# EAGLE board shimboard_revC_V5 (EAGLE 9.1.1), part 1 of 3
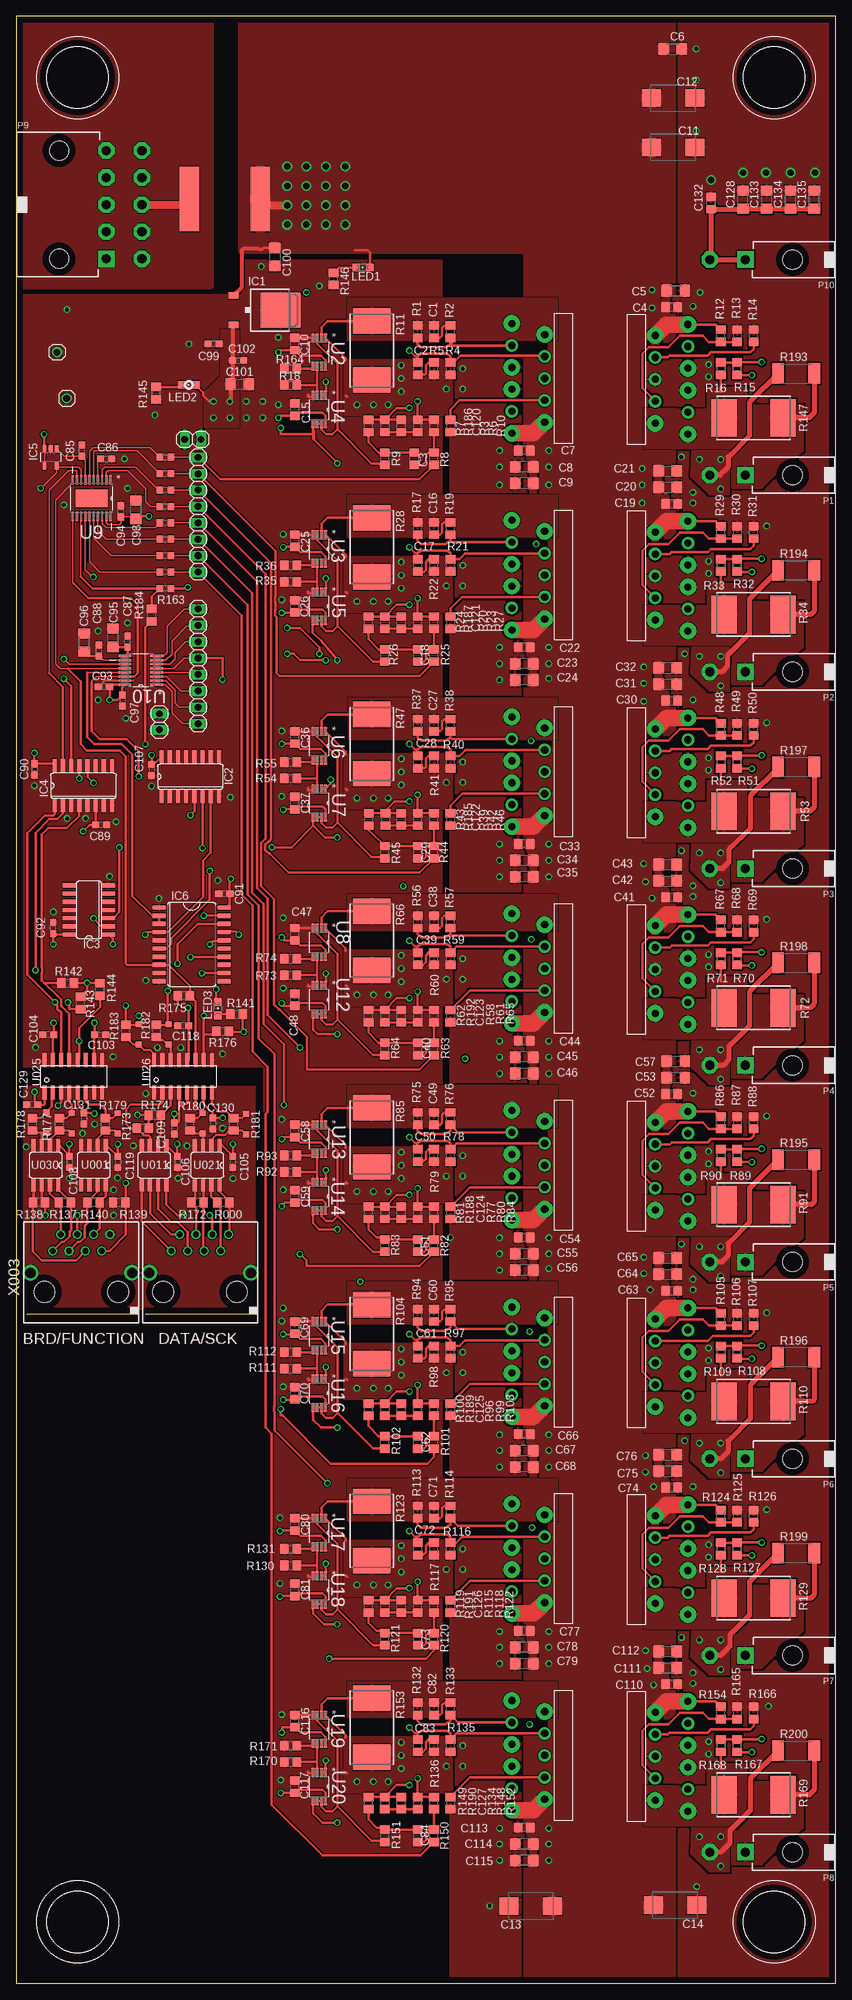
[diagram p5: board, top side]
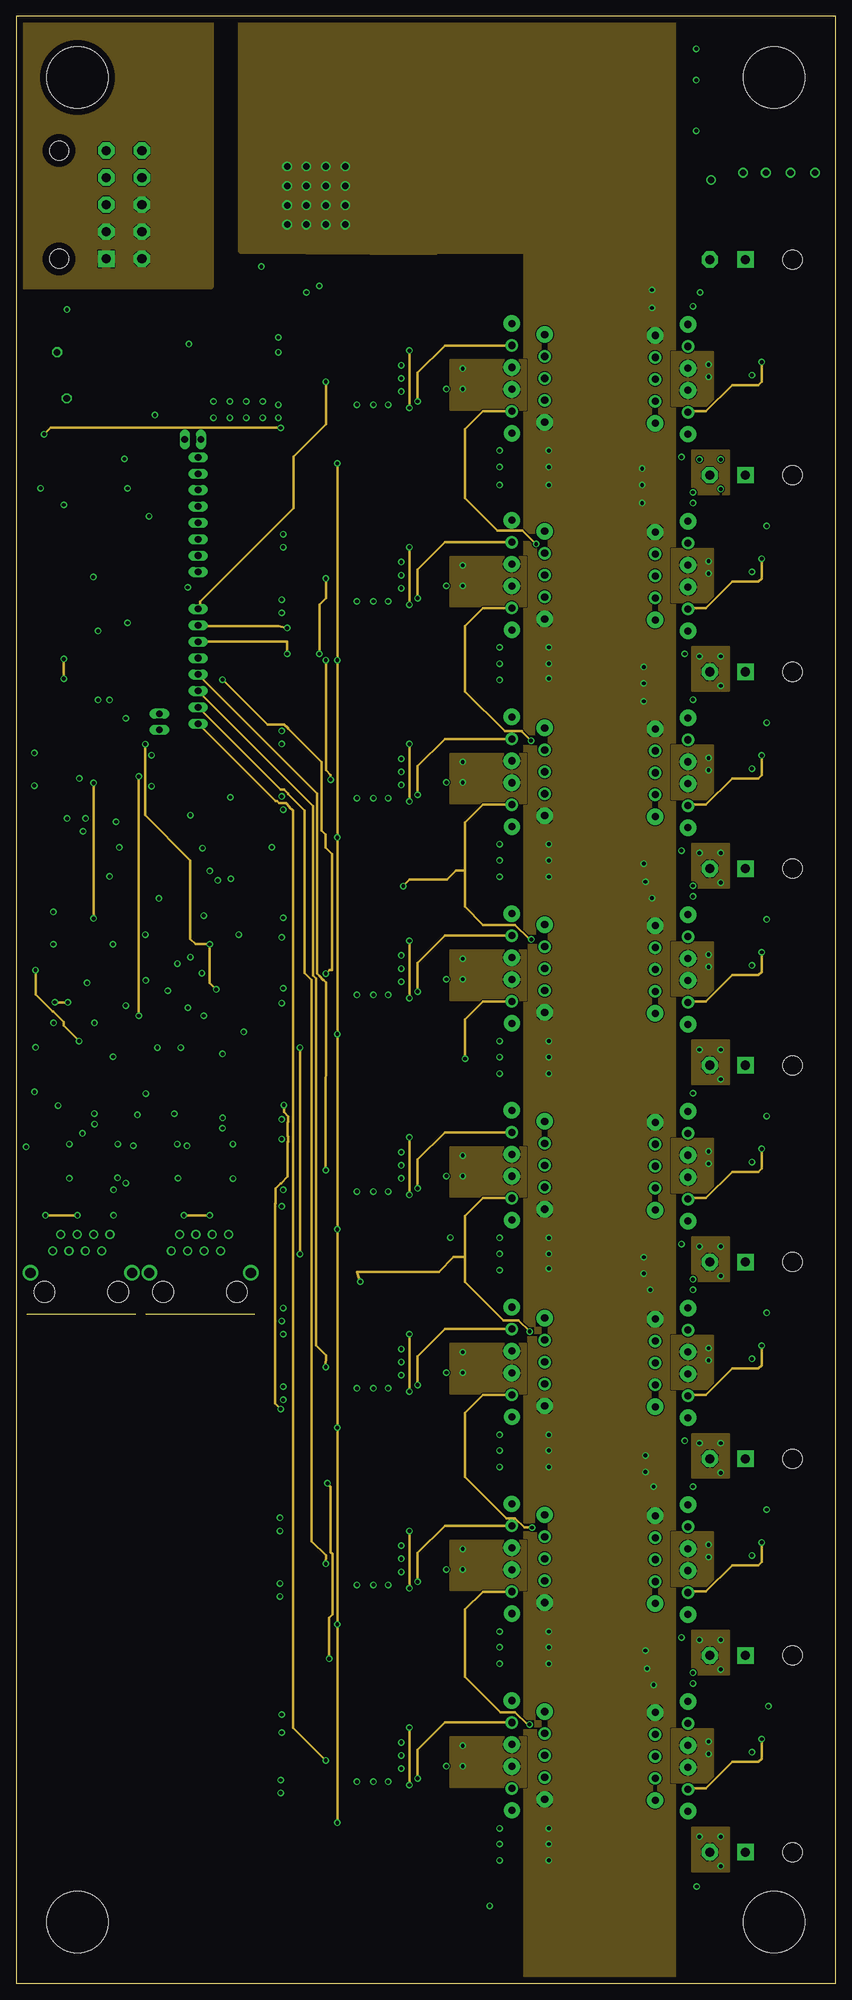
[diagram p6: board, inner layer Route2]
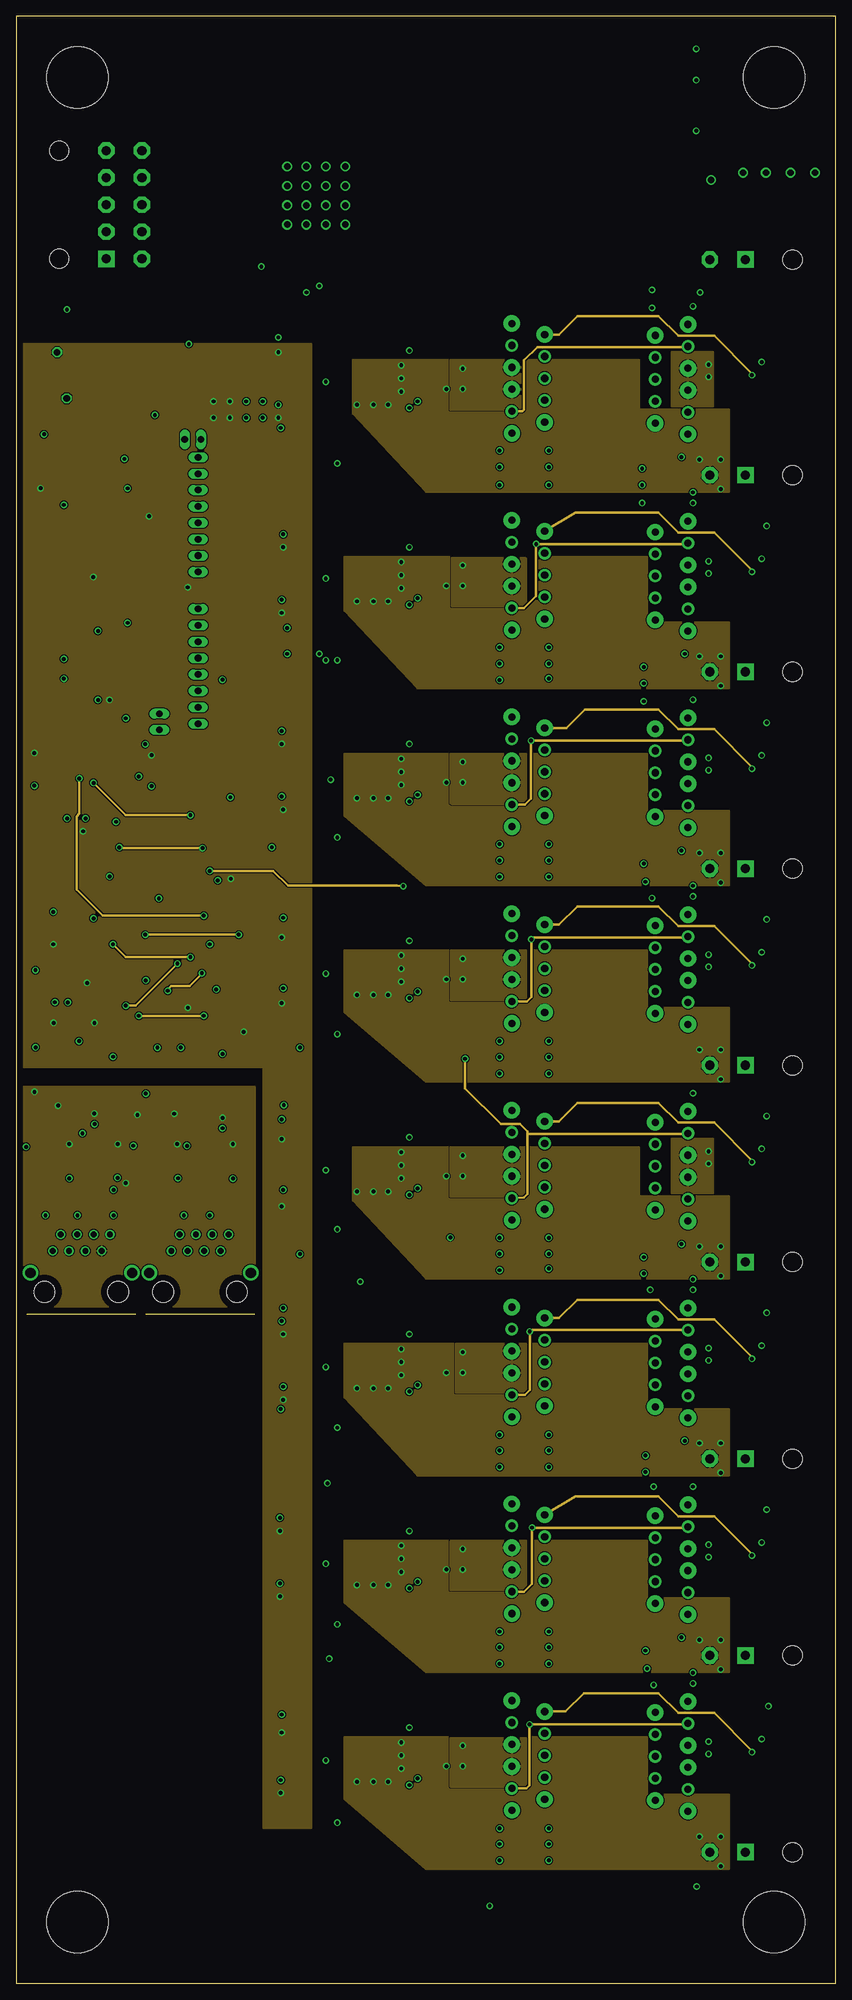
[diagram p7: board, inner layer Route15]
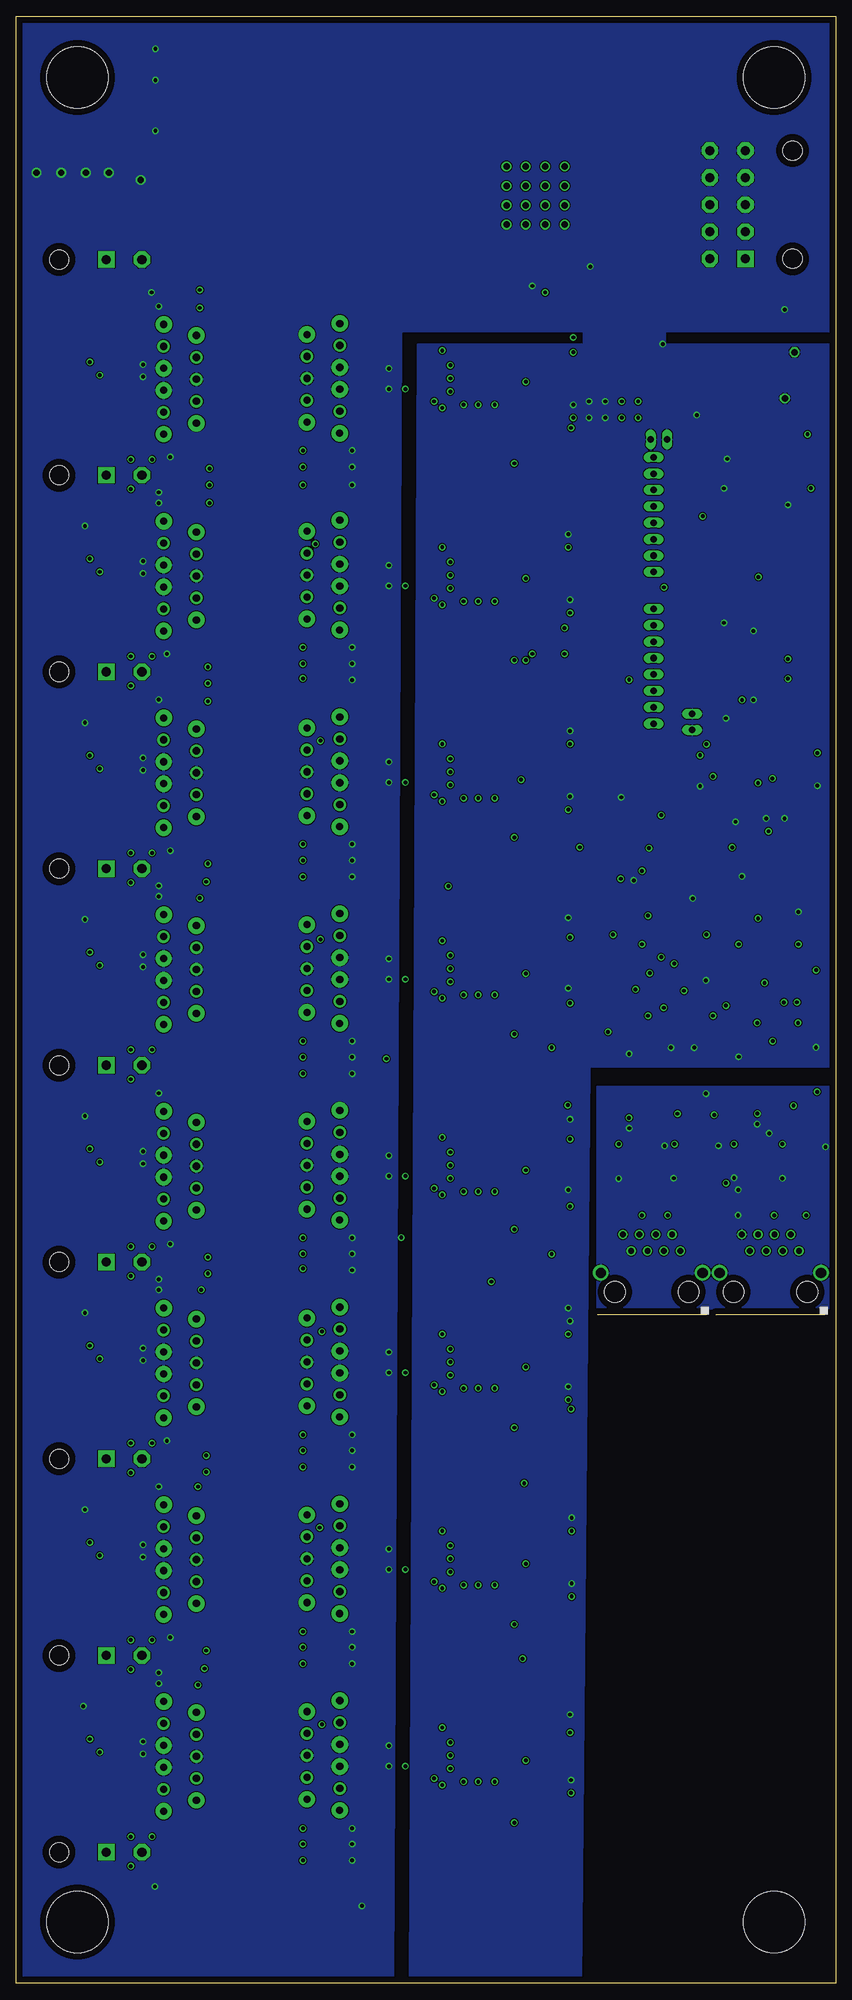
[diagram p8: board, bottom side, seen from below]

Size 127 x 304.8 mm. Coordinates in mm from the lower left corner, seen from the top.
Outline: 0,0 127,0 127,304.8 0,304.8 0,0
Copper layers (1+2*15+16): Top 0.035mm / dielectric 0.5mm / Route2 0.035mm / dielectric 0.5mm / Route15 0.035mm / dielectric 0.5mm / Bottom 0.035mm
Design rules "default *": minimum track width 10mil, minimum drill 0.3mm, track to track 6mil, track to pad 6mil, pad to pad 6mil, via to via 0.3mm, smd to smd 6mil, copper to edge 40mil, drill to drill 0.3mm, minimum pad ring 10mil, minimum via ring 8mil, stop-mask expansion 4mil, vias tented up to drill 0mil, thermal gap 6mil
Holes 9.53 mm at 9.53,9.53 117.47,9.53 9.53,295.27 117.47,295.27
tKeepout: area 3.4,3.4 to 15.6,15.6; area 111.4,3.4 to 123.6,15.6; area 3.4,289.2 to 15.6,301.4; area 111.4,289.2 to 123.6,301.4

## Footprints (pad centres in the part's own frame; a part is rotated, then mirrored left to right if it is on the bottom)
C0805 = smd 1.3 x 1.5: 1 -0.95,0; 2 0.95,0
C1206 = smd 1.6 x 1.8: 1 -1.4,0; 2 1.4,0
D/7343-31W = smd 2.95 x 2.7: + 3.375,0; - -3.375,0
C0603 = smd 1.1 x 1: 1 -0.85,0; 2 0.85,0
LINEAR_TO252 = smd 1 x 1.6: 1 -2.28,-4.8; 2 2.28,-4.8 | smd 5.4 x 6.2: 3 0,2.5
SO16 = smd 0.66 x 2.032: 1 -4.445,-3.073; 2 -3.175,-3.073; 3 -1.905,-3.073; 4 -0.635,-3.073; 5 0.635,-3.073; 6 1.905,-3.073; 7 3.175,-3.073; 8 4.445,-3.073; 9 4.445,3.073; 10 3.175,3.073; 11 1.905,3.073; 12 0.635,3.073; 13 -0.635,3.073; 14 -1.905,3.073; 15 -3.175,3.073; 16 -4.445,3.073
SO14 = smd 0.66 x 2.032: 1 -3.81,-3.073; 2 -2.54,-3.073; 3 -1.27,-3.073; 4 0,-3.073; 5 1.27,-3.073; 6 2.54,-3.073; 7 3.81,-3.073; 8 3.81,3.073; 9 2.54,3.073; 10 1.27,3.073; 11 0,3.073; 12 -1.27,3.073; 13 -2.54,3.073; 14 -3.81,3.073
SOT23-5 = smd 0.6 x 1.2: 1 -0.95,-1.306; 2 0,-1.306; 3 0.95,-1.306; 4 0.95,1.306; 5 -0.95,1.306
SO20W = smd 0.66 x 2.032: 1 -5.715,-5.029; 2 -4.445,-5.029; 3 -3.175,-5.029; 4 -1.905,-5.029; 5 -0.635,-5.029; 6 0.635,-5.029; 7 1.905,-5.029; 8 3.175,-5.029; 9 4.445,-5.029; 10 5.715,-5.029; 11 5.715,5.029; 12 4.445,5.029; 13 3.175,5.029; 14 1.905,5.029; 15 0.635,5.029; 16 -0.635,5.029; 17 -1.905,5.029; 18 -3.175,5.029; 19 -4.445,5.029; 20 -5.715,5.029
1X08 = drill 1.016 long: 1 -8.89,0; 2 -6.35,0; 3 -3.81,0; 4 -1.27,0; 5 1.27,0; 6 3.81,0; 7 6.35,0; 8 8.89,0
1X02 = drill 1.016 long: 1 -1.27,0; 2 1.27,0
1X01 = drill 1.016 octagon: 1 0,0
CHIPLED_0805 = smd 1.2 x 1.2: A 0,-1.05; C 0,1.05
39-30-?02? = drill 1.422 pad 2.54 square: 1 0,0 | drill 1.422 pad 2.54 octagon: 2 0,5.512 | hole 3: 0,-7.3
39-30-?10? = drill 1.422 pad 2.54 square: 1 8.382,0 | drill 1.422 pad 2.54 octagon: 2 4.191,0; 3 0,0; 4 -4.191,0; 5 -8.382,0; 6 8.382,5.512; 7 4.191,5.512; 8 0,5.512; 9 -4.191,5.512; 10 -8.382,5.512 | hole 3: -8.382,-7.3; 8.382,-7.3
R0805 = smd 1.3 x 1.5: 1 -0.95,0; 2 0.95,0
R4527 = smd 3.94 x 5.84: 1 -4.575,0; 2 4.575,0
M0805 = smd 1.3 x 1.6: 1 -0.95,0; 2 0.95,0
R0603 = smd 1 x 1.1: 1 -0.85,0; 2 0.85,0
R2512 = smd 1.8 x 3.2: 1 -2.8,0; 2 2.8,0
SO08-1 = smd 0.66 x 2.032: 1 -1.905,-3.073; 2 -0.635,-3.073; 3 0.635,-3.073; 4 1.905,-3.073; 5 1.905,3.073; 6 0.635,3.073; 7 -0.635,3.073; 8 -1.905,3.073
SOP65P490X110-8N = smd 1.422 x 0.432: 1 -2.184,0.965; 2 -2.184,0.33; 3 -2.184,-0.33; 4 -2.184,-0.965; 5 2.184,-0.965; 6 2.184,-0.33; 7 2.184,0.33; 8 2.184,0.965
SOP65P640X120-21N = smd 1.473 x 0.356: 1 -2.819,2.921; 2 -2.819,2.286; 3 -2.819,1.626; 4 -2.819,0.965; 5 -2.819,0.33; 6 -2.819,-0.33; 7 -2.819,-0.965; 8 -2.819,-1.626; 9 -2.819,-2.286; 10 -2.819,-2.921; 11 2.819,-2.921; 12 2.819,-2.286; 13 2.819,-1.626; 14 2.819,-0.965; 15 2.819,-0.33; 16 2.819,0.33; 17 2.819,0.965; 18 2.819,1.626; 19 2.819,2.286; 20 2.819,2.921 | smd 2.743 x 4.953: 21 0,0
SOP63P600X175-16N = smd 1.981 x 0.356: 1 -2.464,2.235; 2 -2.464,1.575; 3 -2.464,0.965; 4 -2.464,0.305; 5 -2.464,-0.305; 6 -2.464,-0.965; 7 -2.464,-1.575; 8 -2.464,-2.235; 9 2.464,-2.235; 10 2.464,-1.575; 11 2.464,-0.965; 12 2.464,-0.305; 13 2.464,0.305; 14 2.464,0.965; 15 2.464,1.575; 16 2.464,2.235
ACSL-SO16 = smd 2.16 x 0.64: 1 -0.96,9.6; 2 -0.96,8.32; 3 -0.96,7.04; 4 -0.96,5.76; 5 -0.96,4.48; 6 -0.96,3.2; 7 -0.96,1.92; 8 -0.96,0.64; 9 4.05,0.64; 10 4.05,1.92; 11 4.05,3.2; 12 4.05,4.48; 13 4.05,5.76; 14 4.05,7.04; 15 4.05,8.32; 16 4.05,9.6
881 = smd 3 x 10: P$1 -5,0; P$2 6,0
1N4148 = smd 0.9 x 0.95: 1 -1.6,0; 2 1.55,0
OPA549 = drill 1.1 pad 2.54: PIN$1 0,0; PIN$2 1.7,5.08; PIN$5 6.8,0; PIN$7 10.2,0; PIN$10 15.3,5.08; PIN$11 17,0.02 | drill 1.1 pad 1.93: PIN$3 3.4,0; PIN$4 5.1,5.08; PIN$6 8.5,5.08; PIN$8 11.9,5.08; PIN$9 13.6,0
RJ45-VERTICAL = drill 0.9 pad 1.4: 1 -4.445,6.35; 2 -3.175,8.89; 3 -1.905,6.35; 4 -0.635,8.89; 5 0.635,6.35; 6 1.905,8.89; 7 3.175,6.35; 8 4.445,8.89 | drill 1.6 pad 2.1: G1 -7.875,2.95; G2 7.875,2.95 | hole 3.251: -5.715,0; 5.715,0

## Placement (x,y rotation side)
C1  100pF  [C0805]  64.77,255.91 90 top
C2  100pF  [C0805]  62.23,250.19 90 top
C3  1n  [C0805]  61.73,236.22 90 top
C4  0.1uF  [C0805]  101.6,259.71 0 top
C5  10uF  [C1206]  102.23,262.25 0 top
C6  10uF  [C1206]  101.73,299.72 0 top
C7  0.1uF  [C0805]  78.74,237.49 180 top
C8  10uF  [C1206]  78.74,234.95 180 top
C9  10uF  [C1206]  78.74,232.41 180 top
C10  0.1uF  [C0805]  43.18,254 90 top
C11  100u  [D/7343-31W]  101.85,284.48 180 top
C12  100u  [D/7343-31W]  101.85,292.1 180 top
C13  100u  [D/7343-31W]  79.76,11.99 0 top
C14  100u  [D/7343-31W]  102.11,12.11 180 top
C15  0.1uF  [C0805]  43.18,243.84 90 top
C16  100pF  [C0805]  64.77,225.43 90 top
C17  100pF  [C0805]  62.23,219.71 90 top
C18  1n  [C0805]  62.23,205.74 90 top
C19  0.1uF  [C0805]  101.6,229.24 0 top
C20  10uF  [C1206]  100.97,231.78 0 top
C21  10uF  [C1206]  100.97,234.31 0 top
C22  0.1uF  [C0805]  78.74,207.01 180 top
C23  10uF  [C1206]  78.74,204.47 180 top
C24  10uF  [C1206]  78.74,201.93 180 top
C25  0.1uF  [C0805]  43.18,223.52 90 top
C26  0.1uF  [C0805]  43.18,213.36 90 top
C27  100pF  [C0805]  64.77,194.94 90 top
C28  100pF  [C0805]  62.23,189.23 90 top
C29  1n  [C0805]  62.23,175.26 90 top
C30  0.1uF  [C0805]  101.6,198.75 0 top
C31  10uF  [C1206]  100.97,201.29 0 top
C32  10uF  [C1206]  100.97,203.84 0 top
C33  0.1uF  [C0805]  78.74,176.53 180 top
C34  10uF  [C1206]  78.74,173.99 180 top
C35  10uF  [C1206]  78.74,171.45 180 top
C36  0.1uF  [C0805]  43.18,193.04 90 top
C37  0.1uF  [C0805]  43.18,182.88 90 top
C38  100pF  [C0805]  64.77,164.47 90 top
C39  100pF  [C0805]  62.23,158.75 90 top
C40  1n  [C0805]  62.23,144.78 90 top
C41  0.1uF  [C0805]  101.6,168.28 0 top
C42  10uF  [C1206]  100.97,170.81 0 top
C43  10uF  [C1206]  100.97,173.35 0 top
C44  0.1uF  [C0805]  78.74,146.05 180 top
C45  10uF  [C1206]  78.74,143.51 180 top
C46  10uF  [C1206]  78.74,140.97 180 top
C47  0.1uF  [C0805]  43.18,162.56 90 top
C48  0.1uF  [C0805]  43.18,152.4 90 top
C49  100pF  [C0805]  64.77,133.99 90 top
C50  100pF  [C0805]  62.23,128.27 90 top
C51  1n  [C0805]  62.23,114.3 90 top
C52  0.1uF  [C0805]  101.6,137.79 0 top
C53  10uF  [C1206]  102.23,140.34 0 top
C54  0.1uF  [C0805]  78.74,115.57 180 top
C55  10uF  [C1206]  78.74,113.03 180 top
C56  10uF  [C1206]  78.74,110.49 180 top
C57  10uF  [C1206]  102.23,142.88 0 top
C58  0.1uF  [C0805]  43.18,132.08 90 top
C59  0.1uF  [C0805]  43.18,121.92 90 top
C60  100pF  [C0805]  64.77,103.5 90 top
C61  100pF  [C0805]  62.23,97.79 90 top
C62  1n  [C0805]  62.23,83.82 90 top
C63  0.1uF  [C0805]  101.6,107.31 0 top
C64  10uF  [C1206]  100.97,109.86 0 top
C65  10uF  [C1206]  100.97,112.39 0 top
C66  0.1uF  [C0805]  78.74,85.09 180 top
C67  10uF  [C1206]  78.74,82.55 180 top
C68  10uF  [C1206]  78.74,80.01 180 top
C69  0.1uF  [C0805]  43.18,101.6 90 top
C70  0.1uF  [C0805]  43.18,91.44 90 top
C71  100pF  [C0805]  64.77,73.03 90 top
C72  100pF  [C0805]  62.23,67.31 90 top
C73  1n  [C0805]  62.23,53.34 90 top
C74  0.1uF  [C0805]  101.6,76.83 0 top
C75  10uF  [C1206]  100.97,79.38 0 top
C76  10uF  [C1206]  100.97,81.92 0 top
C77  0.1uF  [C0805]  78.74,54.61 180 top
C78  10uF  [C1206]  78.74,52.07 180 top
C79  10uF  [C1206]  78.74,49.53 180 top
C80  0.1uF  [C0805]  43.18,71.12 90 top
C81  0.1uF  [C0805]  43.18,60.96 90 top
C82  100pF  [C0805]  64.77,42.55 90 top
C83  100pF  [C0805]  62.23,36.83 90 top
C84  1n  [C0805]  62.23,22.86 90 top
C85  0.1uF  [C0603]  10.18,237.47 90 top
C86  0.1uF  [C0603]  13.99,236.2 0 top
C87  0.1uF  [C0603]  17.29,207.88 90 top
C88  0.1uF  [C0603]  12.84,206.48 90 top
C89  0.1uF  [C0603]  13.16,179.5 0 top
C90  0.1uF  [C0603]  2.81,188.11 270 top
C91  0.1uF  [C0603]  32.27,168.85 180 top
C92  0.1uF  [C0603]  5.75,163.5 90 top
C93  0.1uF  [C0603]  13.61,200.89 180 top
C94  0.1uF  [C0603]  16.27,228.07 90 top
C95  10uF  [C1206]  15,208.5 90 top
C96  10uF  [C1206]  10.56,207.73 90 top
C97  1uF  [C0603]  16.47,198.78 270 top
C98  10uF  [C1206]  18.56,228.32 90 top
C99  0.1uF  [C0603]  30.59,254 180 top
C100  10uF  [C1206]  40.09,267.5 270 top
C101  10uF  [C1206]  34.65,247.78 0 top
C102  0.1uF  [C0603]  34.4,251.46 0 top
C103  0.1uF  [C0603]  13,147 0 top
C104  0.1uF  [C0603]  5,147 180 top
C105  0.1uF  [C0603]  33.62,127.25 270 top
C106  0.1uF  [C0603]  25.01,127.25 270 top
C107  0.1uF  [C0603]  21,188 270 top
C108  0.1uF  [C0603]  8.25,127.25 270 top
C109  0.1uF  [C0603]  24.51,132.46 270 top
C110  0.1uF  [C0805]  101.6,46.35 0 top
C111  10uF  [C1206]  100.97,48.9 0 top
C112  10uF  [C1206]  100.97,51.44 0 top
C113  0.1uF  [C0805]  78.74,24.13 180 top
C114  10uF  [C1206]  78.74,21.59 180 top
C115  10uF  [C1206]  78.74,19.05 180 top
C116  0.1uF  [C0805]  43.18,40.64 90 top
C117  0.1uF  [C0805]  43.18,30.48 90 top
C118  0.1uF  [C0603]  25.9,148.4 180 top
C119  0.1uF  [C0603]  15.75,127.25 270 top
C120  220p  [C0805]  59.69,241.3 90 top
C121  220p  [C0805]  59.69,210.82 90 top
C122  220p  [C0805]  59.69,180.34 90 top
C123  220p  [C0805]  59.69,149.86 90 top
C124  220p  [C0805]  59.69,119.38 90 top
C125  220p  [C0805]  59.69,88.9 90 top
C126  220p  [C0805]  59.69,58.42 90 top
C127  220p  [C0805]  59.69,27.94 90 top
C128  10u  [C1206]  112.65,276.35 90 top
C129  0.1uF  [C0603]  2.5,136.12 180 top
C130  0.1uF  [C0603]  30.48,133.22 270 top
C131  0.1uF  [C0603]  10.5,133.98 270 top
C132  0.1u  [C0805]  107.7,275.84 90 top
C133  10u  [C1206]  116.33,276.35 90 top
C134  10u  [C1206]  120.02,276.35 90 top
C135  10u  [C1206]  123.7,276.35 90 top
IC1  LINEAR_7805DT  [LINEAR_TO252]  38.5,259.25 270 top
IC2  74LS279D  [SO16]  27,187 0 top
IC3  7400D  [SO14]  11.3,166.32 90 top
IC4  74LS138D  [SO16]  10.43,185.57 0 top
IC5  LMV321M5  [SOT23-5]  5.35,236.45 180 top
IC6  74LS240DW  [SO20W]  27.21,160.98 270 top
JP1  [1X08]  28.21,204.06 270 top
JP2  [1X08]  28.21,227.56 270 top
JP3  [1X02]  22.21,195.46 90 top
JP4  [1X02]  27.39,239.21 180 top
JP5  [1X01]  7.84,245.58 0 top
JP6  [1X01]  6.35,252.73 0 top
LED1  [CHIPLED_0805]  53.78,265.85 90 top
LED2  [CHIPLED_0805]  26.78,247.65 90 top
LED3  [CHIPLED_0805]  31.25,151 0 top
P1  39-30-02?_S  [39-30-?02?]  113.03,233.68 90 top
P2  39-30-02?_S  [39-30-?02?]  113.03,203.2 90 top
P3  39-30-02?_S  [39-30-?02?]  113.03,172.72 90 top
P4  39-30-02?_S  [39-30-?02?]  113.03,142.24 90 top
P5  39-30-02?_S  [39-30-?02?]  113.03,111.76 90 top
P6  39-30-02?_S  [39-30-?02?]  113.03,81.28 90 top
P7  39-30-02?_S  [39-30-?02?]  113.03,50.8 90 top
P8  39-30-02?_S  [39-30-?02?]  113.03,20.32 90 top
P9  39-30-10?_S  [39-30-?10?]  13.97,275.59 270 top
P10  39-30-02?_S  [39-30-?02?]  113.03,267.08 90 top
R000  100  [R0805]  32.12,121 180 top
R1  51.1k  [R0805]  62.23,255.91 90 top
R2  5.1k  [R0805]  67.31,255.91 90 top
R3  22k  [R0805]  62.23,241.3 90 top
R4  51.1k  [R0805]  67.31,250.19 90 top
R5  5.1k  [R0805]  64.77,250.19 90 top
R6  68.1k  [R0805]  64.77,241.3 90 top
R7  68.1k  [R0805]  54.61,241.3 90 top
R8  10k  [R0805]  64.77,236.22 90 top
R9  10k  [R0805]  57.15,236.22 90 top
R10  10k  [R0805]  67.31,241.3 270 top
R11  0.2  [R4527]  55.12,252.98 270 top
R12  2k  [M0805]  109.22,255.27 270 top
R13  2k  [R0805]  111.76,255.27 270 top
R14  10k  [R0805]  114.3,255.27 90 top
R15  2k  [R0805]  111.76,250.19 90 top
R16  2k  [R0805]  109.22,250.19 270 top
R17  51.1k  [R0805]  62.23,225.43 90 top
R18  10k  [R0805]  42.55,247.65 0 top
R19  5.1k  [R0805]  67.31,225.43 90 top
R20  22k  [R0805]  62.23,210.82 90 top
R21  51.1k  [R0805]  67.31,219.71 90 top
R22  5.1k  [R0805]  64.77,219.71 90 top
R23  68.1k  [R0805]  64.77,210.82 90 top
R24  68.1k  [R0805]  54.61,210.82 90 top
R25  10k  [R0805]  64.77,205.74 90 top
R26  10k  [R0805]  57.15,205.74 90 top
R27  10k  [R0805]  67.31,210.82 270 top
R28  0.2  [R4527]  55.12,222.5 270 top
R29  2k  [M0805]  109.22,224.79 270 top
R30  2k  [R0805]  111.76,224.79 270 top
R31  10k  [R0805]  114.3,224.79 90 top
R32  2k  [R0805]  111.76,219.71 90 top
R33  2k  [R0805]  109.22,219.71 270 top
R34  0.2  [R4527]  114.3,212.09 0 top
R35  10k  [R0805]  42.55,217.17 0 top
R36  10k  [R0805]  42.55,219.71 0 top
R37  51.1k  [R0805]  62.23,194.94 90 top
R38  5.1k  [R0805]  67.31,194.94 90 top
R39  22k  [R0805]  62.23,180.34 90 top
R40  51.1k  [R0805]  67.31,189.23 90 top
R41  5.1k  [R0805]  64.77,189.23 90 top
R42  68.1k  [R0805]  64.77,180.34 90 top
R43  68.1k  [R0805]  54.65,180.34 90 top
R44  10k  [R0805]  64.77,175.26 90 top
R45  10k  [R0805]  57.15,175.26 90 top
R46  10k  [R0805]  67.31,180.34 270 top
R47  0.2  [R4527]  55.12,192.02 270 top
R48  2k  [M0805]  109.22,194.31 270 top
R49  2k  [R0805]  111.76,194.31 270 top
R50  10k  [R0805]  114.3,194.31 90 top
R51  2k  [R0805]  111.76,189.23 90 top
R52  2k  [R0805]  109.22,189.23 270 top
R53  0.2  [R4527]  114.3,181.61 0 top
R54  10k  [R0805]  42.55,186.69 0 top
R55  10k  [R0805]  42.55,189.23 0 top
R56  51.1k  [R0805]  62.23,164.47 90 top
R57  5.1k  [R0805]  67.31,164.47 90 top
R58  22k  [R0805]  62.23,149.86 90 top
R59  51.1k  [R0805]  67.31,158.75 90 top
R60  5.1k  [R0805]  64.77,158.75 90 top
R61  68.1k  [R0805]  64.77,149.86 90 top
R62  68.1k  [R0805]  54.61,149.86 90 top
R63  10k  [R0805]  64.77,144.78 90 top
R64  10k  [R0805]  57.15,144.78 90 top
R65  10k  [R0805]  67.31,149.86 270 top
R66  0.2  [R4527]  55.12,161.54 270 top
R67  2k  [M0805]  109.22,163.83 270 top
R68  2k  [R0805]  111.76,163.83 270 top
R69  10k  [R0805]  114.3,163.83 90 top
R70  2k  [R0805]  111.76,158.75 90 top
R71  2k  [R0805]  109.22,158.75 270 top
R72  0.2  [R4527]  114.3,151.13 0 top
R73  10k  [R0805]  42.55,156.21 0 top
R74  10k  [R0805]  42.55,158.75 0 top
R75  51.1k  [R0805]  62.23,133.99 90 top
R76  5.1k  [R0805]  67.31,133.99 90 top
R77  22k  [R0805]  62.23,119.38 90 top
R78  51.1k  [R0805]  67.31,128.27 90 top
R79  5.1k  [R0805]  64.77,128.27 90 top
R80  68.1k  [R0805]  64.77,119.38 90 top
R81  68.1k  [R0805]  54.61,119.38 90 top
R82  10k  [R0805]  64.77,114.3 90 top
R83  10k  [R0805]  57.15,114.3 90 top
R84  10k  [R0805]  67.31,119.38 270 top
R85  0.2  [R4527]  55.12,131.06 270 top
R86  2k  [M0805]  109.22,133.35 270 top
R87  2k  [R0805]  111.76,133.35 270 top
R88  10k  [R0805]  114.3,133.35 90 top
R89  2k  [R0805]  111.76,128.27 90 top
R90  2k  [R0805]  109.22,128.27 270 top
R91  0.2  [R4527]  114.3,120.65 0 top
R92  10k  [R0805]  42.55,125.73 0 top
R93  10k  [R0805]  42.55,128.27 0 top
R94  51.1k  [R0805]  62.23,103.5 90 top
R95  5.1k  [R0805]  67.31,103.5 90 top
R96  22k  [R0805]  62.23,88.9 90 top
R97  51.1k  [R0805]  67.31,97.79 90 top
R98  5.1k  [R0805]  64.77,97.79 90 top
R99  68.1k  [R0805]  64.77,88.9 90 top
R100  68.1k  [R0805]  54.61,88.9 90 top
R101  10k  [R0805]  64.77,83.82 90 top
R102  10k  [R0805]  57.15,83.82 90 top
R103  10k  [R0805]  67.31,88.9 270 top
R104  0.2  [R4527]  55.12,100.58 270 top
R105  2k  [M0805]  109.22,102.87 270 top
R106  2k  [R0805]  111.76,102.87 270 top
R107  10k  [R0805]  114.3,102.87 90 top
R108  2k  [R0805]  111.76,97.79 90 top
R109  2k  [R0805]  109.22,97.79 270 top
R110  0.2  [R4527]  114.3,90.17 0 top
R111  10k  [R0805]  42.55,95.25 0 top
R112  10k  [R0805]  42.55,97.79 0 top
R113  51.1k  [R0805]  62.23,73.03 90 top
R114  5.1k  [R0805]  67.31,73.03 90 top
R115  22k  [R0805]  62.23,58.42 90 top
R116  51.1k  [R0805]  67.31,67.31 90 top
R117  5.1k  [R0805]  64.77,67.31 90 top
R118  68.1k  [R0805]  64.77,58.42 90 top
R119  68.1k  [R0805]  54.61,58.42 90 top
R120  10k  [R0805]  64.77,53.34 90 top
R121  10k  [R0805]  57.15,53.34 90 top
R122  10k  [R0805]  67.31,58.42 270 top
R123  0.2  [R4527]  55.12,70.1 270 top
R124  2k  [M0805]  109.22,72.39 270 top
R125  2k  [R0805]  111.76,72.39 270 top
R126  10k  [R0805]  114.3,72.39 90 top
R127  2k  [R0805]  111.76,67.31 90 top
R128  2k  [R0805]  109.22,67.31 270 top
R129  0.2  [R4527]  114.3,59.69 0 top
R130  10k  [R0805]  42.55,64.77 0 top
R131  10k  [R0805]  42.55,67.31 0 top
R132  51.1k  [R0805]  62.23,42.55 90 top
R133  5.1k  [R0805]  67.31,42.55 90 top
R134  22k  [R0805]  62.23,27.94 90 top
R135  51.1k  [R0805]  67.31,36.83 90 top
R136  5.1k  [R0805]  64.77,36.83 90 top
R137  100  [R0805]  7.55,121 0 top
R138  100  [R0805]  3.55,121 180 top
R139  100  [R0805]  16,121 0 top
R140  100  [R0805]  12,121 180 top
R141  2k  [R0805]  34.17,150.19 0 top
R142  330  [R0805]  8,155 0 top
R143  330  [R0805]  10,151.9 90 top
R144  330  [R0805]  13,154 90 top
R145  2k  [R0805]  21.7,246.38 90 top
R146  2k  [R0805]  49.2,264.08 90 top
R147  0.2  [R4527]  114.3,242.57 0 top
R148  68.1k  [R0805]  64.77,27.94 90 top
R149  68.1k  [R0805]  54.61,27.94 90 top
R150  10k  [R0805]  64.77,22.86 90 top
R151  10k  [R0805]  57.15,22.86 90 top
R152  10k  [R0805]  67.31,27.94 270 top
R153  0.2  [R4527]  55.12,39.62 270 top
R154  2k  [M0805]  109.22,41.91 270 top
R155  0  [R0603]  23.13,236.45 0 top
R156  0  [R0603]  23.13,233.91 0 top
R157  0  [R0603]  23.13,231.37 0 top
R158  0  [R0603]  23.13,228.83 0 top
R159  0  [R0603]  23.13,226.29 0 top
R160  0  [R0603]  23.13,223.75 0 top
R161  0  [R0603]  23.13,221.21 0 top
R162  0  [R0603]  23.13,218.67 0 top
R163  10k  [R0603]  23.13,216.13 180 top
R164  10k  [R0805]  42.55,250.19 0 top
R165  2k  [R0805]  111.76,41.91 270 top
R166  10k  [R0805]  114.3,41.91 90 top
R167  2k  [R0805]  111.76,36.83 90 top
R168  2k  [R0805]  109.22,36.83 270 top
R169  0.2  [R4527]  114.3,29.21 0 top
R170  10k  [R0805]  42.55,34.29 0 top
R171  10k  [R0805]  42.55,36.83 0 top
R172  100  [R0805]  28.12,121 180 top
R173  330  [R0805]  19.64,132.48 0 top
R174  330  [R0805]  21.49,134.52 180 top
R175  330  [R0805]  26,153 180 top
R176  330  [R0805]  32,147.5 0 top
R177  330  [R0805]  6.73,133.1 90 top
R178  330  [R0805]  2.54,133.1 90 top
R179  330  [R0805]  13.84,133.1 90 top
R180  330  [R0805]  26.96,133.1 90 top
R181  330  [R0805]  33.72,133.1 90 top
R182  330  [R0805]  21.76,147.57 90 top
R183  330  [R0805]  17,147.57 90 top
R184  100  [R0805]  21,212 90 top
R185  2Meg  [R0805]  57.25,180.34 270 top
R186  2Meg  [R0805]  57.15,241.3 270 top
R187  2Meg  [R0805]  57.15,210.82 270 top
R188  2Meg  [R0805]  57.15,119.38 270 top
R189  2Meg  [R0805]  57.15,88.9 270 top
R190  2Meg  [R0805]  57.15,27.94 270 top
R191  2Meg  [R0805]  57.15,58.42 270 top
R192  2Meg  [R0805]  57.15,149.86 270 top
R193  330  [R2512]  120.9,249.43 0 top
R194  330  [R2512]  120.9,218.95 0 top
R195  330  [R2512]  120.9,127.64 0 top
R196  330  [R2512]  120.9,97.03 0 top
R197  330  [R2512]  120.9,188.47 0 top
R198  330  [R2512]  120.9,158.12 0 top
R199  330  [R2512]  120.9,66.67 0 top
R200  330  [R2512]  120.9,36.07 0 top
U001  65LVDS34  [SO08-1]  12,126.75 180 top
U2  INA170EA/250  [SOP65P490X110-8N]  46.99,252.73 270 top
U3  INA170EA/250  [SOP65P490X110-8N]  46.99,222.25 270 top
U4  OPA2340EA/250  [SOP65P490X110-8N]  46.99,243.84 270 top
U5  OPA2340EA/250  [SOP65P490X110-8N]  46.99,213.36 270 top
U6  INA170EA/250  [SOP65P490X110-8N]  46.99,191.77 270 top
U7  OPA2340EA/250  [SOP65P490X110-8N]  46.99,182.88 270 top
U8  INA170EA/250  [SOP65P490X110-8N]  46.99,161.29 270 top
U9  LTC2656BCFE-H16PBF  [SOP65P640X120-21N]  11.7,230.1 270 top
U10  LTC1863CGNPBF  [SOP63P600X175-16N]  19.32,203.43 180 top
U011  65LVDS9638  [SO08-1]  21.38,126.75 180 top
U12  OPA2340EA/250  [SOP65P490X110-8N]  46.99,152.4 270 top
U13  INA170EA/250  [SOP65P490X110-8N]  46.99,130.81 270 top
U14  OPA2340EA/250  [SOP65P490X110-8N]  46.99,121.92 270 top
U15  INA170EA/250  [SOP65P490X110-8N]  46.99,100.33 270 top
U16  OPA2340EA/250  [SOP65P490X110-8N]  46.99,91.44 270 top
U17  INA170EA/250  [SOP65P490X110-8N]  46.99,69.85 270 top
U18  OPA2340EA/250  [SOP65P490X110-8N]  46.99,60.96 270 top
U19  INA170EA/250  [SOP65P490X110-8N]  46.99,39.37 270 top
U20  OPA2340EA/250  [SOP65P490X110-8N]  46.99,30.48 270 top
U021  65LVDS34  [SO08-1]  29.62,126.75 180 top
U025  ACSL-6400  [ACSL-SO16]  14,139 90 top
U026  ACSL-6420  [ACSL-SO16]  31,139 90 top
U030  65LVDS34  [SO08-1]  4.6,126.75 180 top
U031  0881070  [881]  31.83,276.5 0 top
U040  1N4148  [1N4148]  8.64,133.22 270 top
U041  1N4148  [1N4148]  4.7,133.35 270 top
U042  1N4148  [1N4148]  15.75,133.22 270 top
U043  1N4148  [1N4148]  28.89,133.22 270 top
U044  1N4148  [1N4148]  35.66,133.1 270 top
U045  1N4148  [1N4148]  23.64,147.07 90 top
U046  1N4148  [1N4148]  19,147.07 90 top
U$1  OPA549_HS677NOHS  [OPA549]  76.83,257.18 270 top
U$2  OPA549_HS677NOHS  [OPA549]  104.14,240.03 90 top
U$3  OPA549_HS677NOHS  [OPA549]  76.83,226.69 270 top
U$4  OPA549_HS677NOHS  [OPA549]  104.14,209.55 90 top
U$5  OPA549_HS677NOHS  [OPA549]  76.83,196.22 270 top
U$6  OPA549_HS677NOHS  [OPA549]  104.14,179.07 90 top
U$7  OPA549_HS677NOHS  [OPA549]  76.83,165.74 270 top
U$8  OPA549_HS677NOHS  [OPA549]  104.14,148.59 90 top
U$9  OPA549_HS677NOHS  [OPA549]  76.83,135.25 270 top
U$10  OPA549_HS677NOHS  [OPA549]  104.14,118.11 90 top
U$11  OPA549_HS677NOHS  [OPA549]  76.83,104.78 270 top
U$12  OPA549_HS677NOHS  [OPA549]  104.14,87.63 90 top
U$13  OPA549_HS677NOHS  [OPA549]  76.83,74.3 270 top
U$14  OPA549_HS677NOHS  [OPA549]  104.14,57.15 90 top
U$15  OPA549_HS677NOHS  [OPA549]  76.83,43.81 270 top
U$16  OPA549_HS677NOHS  [OPA549]  104.14,26.67 90 top
X002  RJ45V  [RJ45-VERTICAL]  28.5,107.13 0 top
X003  RJ45V  [RJ45-VERTICAL]  10.1,107.13 0 top